# EAGLE design TBA820-Amplifier-3 (EAGLE 7.2.0)
Audio-Verstärker mit TBA820
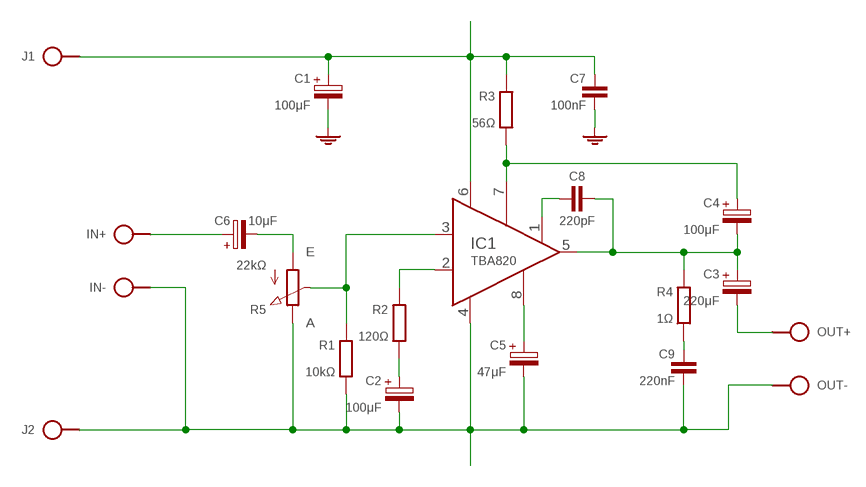
[diagram p0: schematic, sheet 1]

## Parts
C1  100μF  CPOLE2,5-4/V  [E2.5-4/V]
C2  100μF  CPOLE2,5-4/V  [E2.5-4/V]
C3  220μF  CPOLE2.5-5  [E2,5-5]
C4  100μF  CPOLE2,5-4  [E2,5-4]
C5  47μF  CPOLE2,5-3  [E2,5-3]
C6  10μF  CPOL-HE2,5-4/V  [E2.5-4/V]
C7  100nF  C050-020X044/V  [C050-020X044/V]
C8  220pF  C-H025-015X024  [C025-015X024]
C9  220nF  C075-020X044  [C075-020X044]
IC1  TBA820  [DIL08]
IN  SPAD+--+  [SPAD-+]
J1  HPORT  [SPAD]
J2  HPORT  [SPAD]
OUT  SPAD+-+-  [SPAD+-]
R1  10kΩ  R0204/10-V  [0204/10-V]
R2  120Ω  R0204/10-V  [0204/10-V]
R3  56Ω  R0204/10-V  [0204/10-V]
R4  1Ω  R0204/10-V  [0204/10-V]
R5  22kΩ  POT-3P  [CONN-3P]

## Nets
BOOT: C4.+ IC1.7(BOOT) R3.2
FREQ: C8.1 IC1.1(FREQ)
GAIN: IC1.2(GAIN) R2.1
GND: C1.- C7.2
INPUT: IC1.3(INPUT) R1.1 R5.2(S)
N$1: C1.+ C7.1 IC1.6(VCC) J1.1 R3.1
N$2: C2.- C5.- C9.2 IC1.4(GND) IN.1 J2.1 OUT.1 R1.2 R5.3(E)
N$4: C9.1 R4.2
N$5: C6.- R5.1(A)
N$6: C6.+ IN.2
N$10: C3.- OUT.2
N$11: C2.+ R2.2
OUT: C3.+ C4.- C8.2 IC1.5(OUT) R4.1
RIPPLE: C5.+ IC1.8(RIPPLE)

## Library data of the parts
C1-C5 = c:CPOL: POLARIZED CAPACITOR, European symbol
C6 = c:CPOL-H
C7 C9 = c:C: CAPACITOR, European symbol
C8 = c:C-H
IC1 = ic:TBA820
IN OUT = pad:SPAD+-
J1 J2 = pad:HPORT
R1-R4 = r:R: RESISTOR, European symbol
R5 = r:POT

## Board
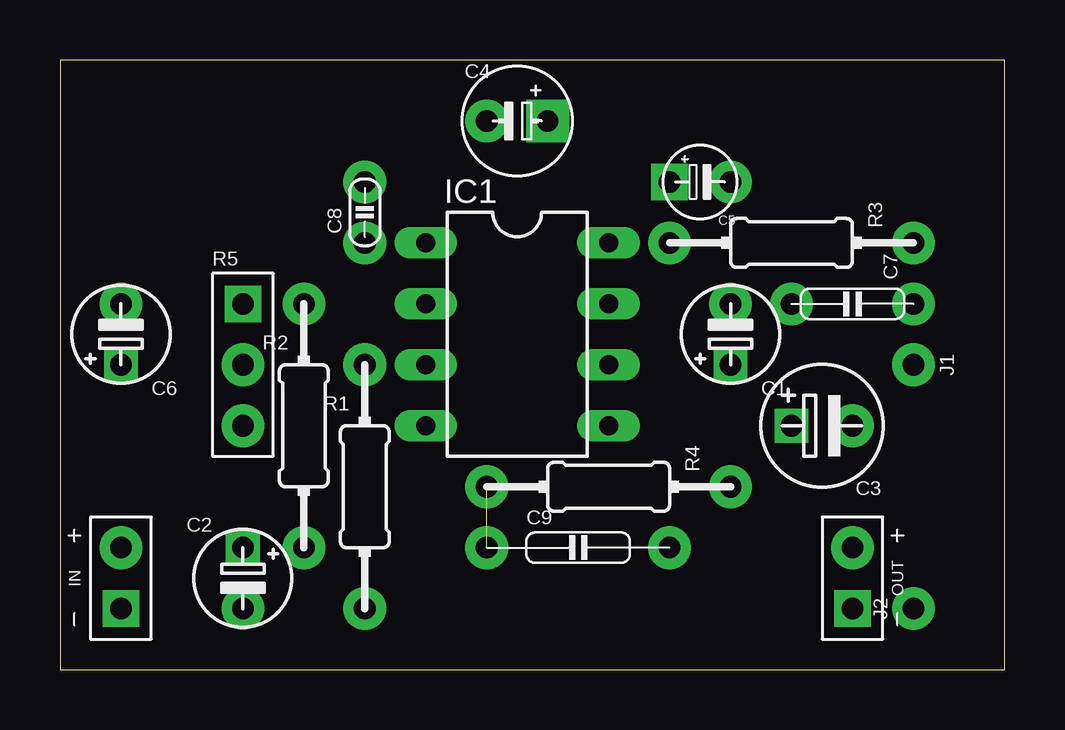
[diagram p1: board, top side]
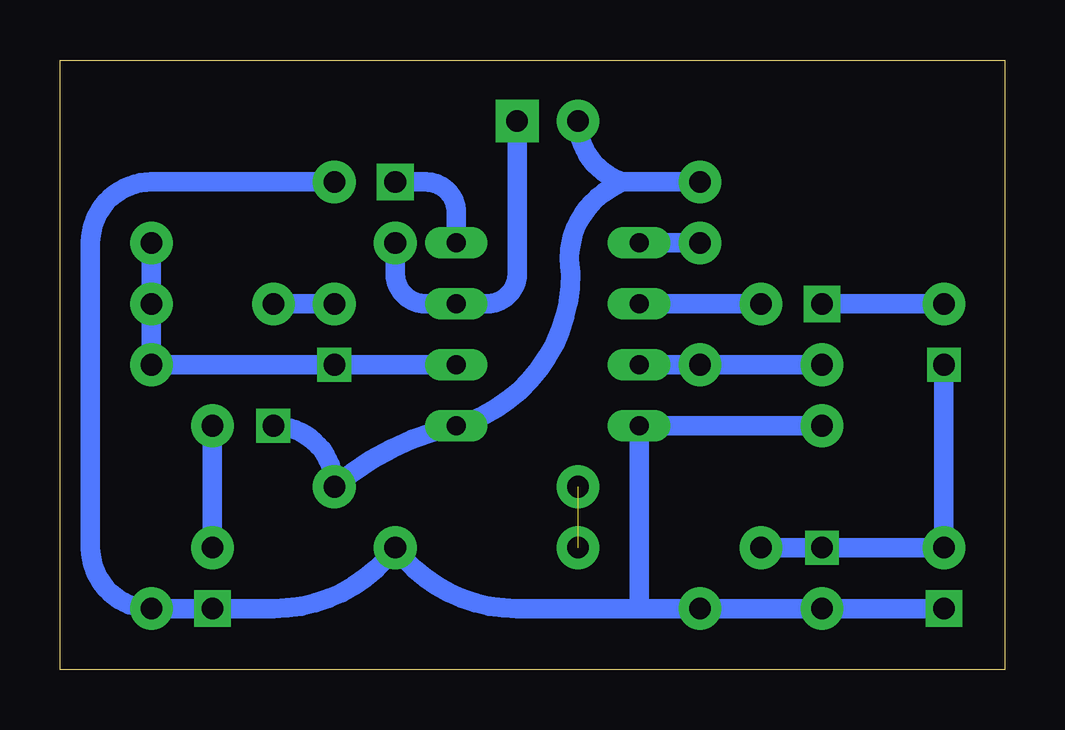
[diagram p2: board, bottom side, seen from below]

Size 39.37 x 25.4 mm. Coordinates in mm from the lower left corner, seen from the top.
Outline: 0,0 39.37,0 39.37,25.4 0,25.4 0,0
Copper layers (1*16): Top 0.035mm / dielectric 1.5mm / Bottom 0.035mm
Design rules "default": minimum track width 10mil, minimum drill 24mil, track to track 8mil, track to pad 8mil, pad to pad 8mil, via to via 8mil, smd to smd 8mil, copper to edge 40mil, drill to drill 8mil, minimum pad ring 10mil, minimum via ring 8mil, stop-mask expansion 4mil, vias tented up to drill 0mil, thermal gap 10mil

### Footprints (pad centres in the part's own frame; a part is rotated, then mirrored left to right if it is on the bottom)
E2.5-4/V = drill 0.9 square: + 0,1.27 | drill 0.9 pad 1.778: - 0,-1.27
E2,5-5 = drill 0.9 square: + 1.27,0 | drill 0.9 pad 1.778: - -1.27,0
E2,5-4 = drill 0.9 pad 1.778 square: + 1.27,0 | drill 0.9 pad 1.778: - -1.27,0
E2,5-3 = drill 0.9 pad 1.524 square: + -1.27,0 | drill 0.9 pad 1.778: - 1.27,0
C050-020X044/V = drill 0.9 pad 1.778: 1 0,2.54; 2 0,-2.54
C025-015X024 = drill 0.9 pad 1.778: 1 -1.27,0; 2 1.27,0
C075-020X044 = drill 0.9 pad 1.778: 1 -2.54,0; 2 5.08,0
DIL08 = drill 0.8 pad 1.27 long: 1 -3.81,3.81; 2 -3.81,1.27; 3 -3.81,-1.27; 4 -3.81,-3.81; 5 3.81,-3.81; 6 3.81,-1.27; 7 3.81,1.27; 8 3.81,3.81
SPAD-+ = drill 0.9 pad 1.524 square: 1 0,-1.27 | drill 0.9 pad 1.778: 2 0,1.27
SPAD = drill 0.9 pad 1.778: 1 0,0
SPAD+- = drill 0.9 pad 1.524 square: 1 0,-1.27 | drill 0.9 pad 1.778: 2 0,1.27
0204/10-V = drill 0.9 pad 1.778: 1 0,5.08; 2 0,-5.08
CONN-3P = drill 0.9 pad 1.524 square: 1 0,2.54 | drill 0.9 pad 1.778: 2 0,0; 3 0,-2.54

### Placement (x,y rotation side)
C1  27.94,13.97 180 top
C2  7.62,3.81 0 top
C3  31.75,10.16 180 top
C4  19.05,22.86 0 top
C5  26.67,20.32 0 top
C6  2.54,13.97 180 top
C7  33.02,15.24 270 top
C8  12.7,19.05 90 top
C9  20.32,5.08 0 top
IC1  19.05,13.97 0 top
IN  2.54,3.81 0 top
J1  35.56,12.7 180 top
J2  35.56,2.54 0 top
OUT  33.02,3.81 0 top
R1  12.7,7.62 0 top
R2  10.16,10.16 0 top
R3  30.48,17.78 270 top
R4  22.86,7.62 270 top
R5  7.62,12.7 0 top

### Tracks (layer width: path | path; a pad name or v marks a point on that pad's centre or on a via)
BOOT
  Bottom 0.813: C4.+ 20.32,16.51 arc90 21.59,15.24 IC1.7 24.13,15.24 arc90 25.4,16.51 R3.2
FREQ
  Bottom 0.813: C8.1 IC1.1
GAIN
  Bottom 0.813: IC1.2 R2.1
GND
  Bottom 0.813: C1.- C7.2
INPUT
  Bottom 0.813: R5.2 R1.1 IC1.3
N$1
  Bottom 0.813: R3.1 C7.1 J1.1 C1.+ IC1.6
N$2
  Bottom 0.813: 15.24,2.54 IC1.4 R5.3 | C5.- 35.56,20.32 arc-90 38.1,17.78 38.1,5.08 arc-90 J2.1 OUT.1 30.48,2.54 arc-53 C9.2 arc-53 20.32,2.54 15.24,2.54 | IN.1 C2.- R1.2 15.24,2.54
N$4  (1 unrouted)
N$5
  Bottom 0.813: C6.- R5.1
N$6
  Bottom 0.813: 10.16,5.08 IN.2 | IN.2 5.08,5.08 | C6.+ IN.2
N$10
  Bottom 0.813: C3.- OUT.2
N$11
  Bottom 0.813: C2.+ R2.2
OUT
  Bottom 0.813: C3.+ arc90 R4.1 arc28 IC1.5 arc-75 18.1,16.51 arc80 15.88,20.32 | C8.2 15.88,20.32 | 15.88,20.32 arc75 C4.-
RIPPLE
  Bottom 0.813: IC1.8 22.86,19.05 arc-90 24.13,20.32 C5.+